# EAGLE schematic atmega_fusebit_doctor_V2hOld (EAGLE 6.4)
AUTHOR: PAWEL KISIELEWSKI (MANEKINEN); REV: 2.0
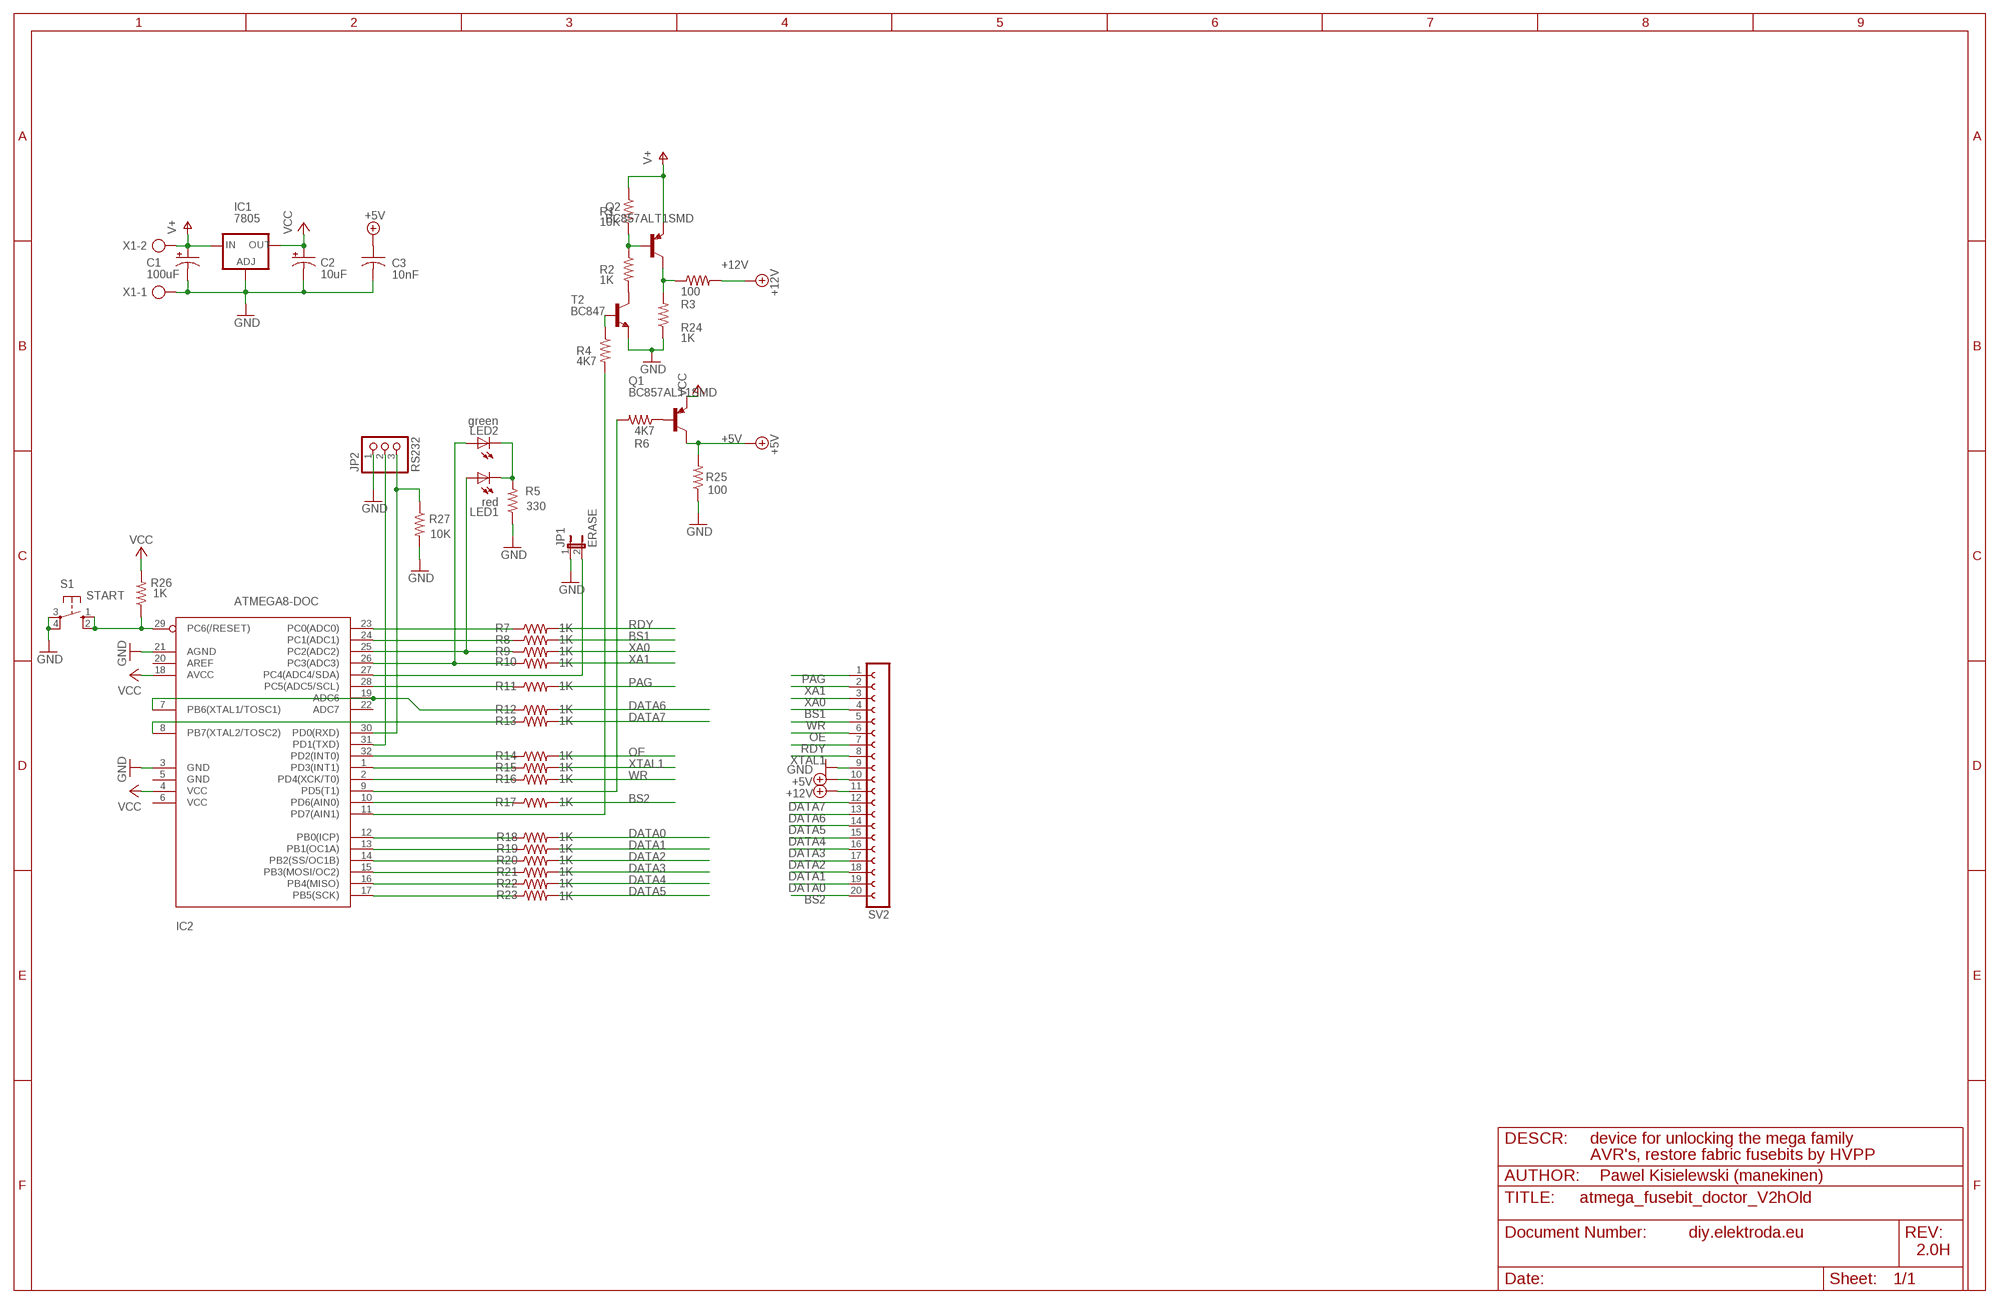
[diagram p0: schematic, sheet 1]

## Parts
C1  100uF  CAP_POL1206  [EIA3216]
C2  10uF  CAP_POL1206  [EIA3216]
C3  10nF  C-USC0805  [C0805]
IC1  7805  V_REG_317DPACK  [V-REG_DPACK]
IC2  ATMEGA8-DOC  AVR-MEGA8-AI  [TQFP32-08]
JP1  ERASE  JP1E  [JP1]
JP2  RS232  PINHD-1X3  [1X03]
LED1  red  LEDSML0603  [SML0603]
LED2  green  LEDSML0603  [SML0603]
Q1  BC857ALT1SMD  [SOT23-BEC]
Q2  BC857ALT1SMD  [SOT23-BEC]
R1  10K  R-US_R0805  [R0805]
R2  1K  R-US_R0805  [R0805]
R3  100  R-US_R0805  [R0805]
R4  4K7  R-US_R0805  [R0805]
R5  330  R-US_R0805  [R0805]
R6  4K7  R-US_R0805  [R0805]
R7  1K  R-US_R0805  [R0805]
R8  1K  R-US_R0805  [R0805]
R9  1K  R-US_R0805  [R0805]
R10  1K  R-US_R0805  [R0805]
R11  1K  R-US_R0805  [R0805]
R12  1K  R-US_R0805  [R0805]
R13  1K  R-US_R0805  [R0805]
R14  1K  R-US_R0805  [R0805]
R15  1K  R-US_R0805  [R0805]
R16  1K  R-US_R0805  [R0805]
R17  1K  R-US_R0805  [R0805]
R18  1K  R-US_R0805  [R0805]
R19  1K  R-US_R0805  [R0805]
R20  1K  R-US_R0805  [R0805]
R21  1K  R-US_R0805  [R0805]
R22  1K  R-US_R0805  [R0805]
R23  1K  R-US_R0805  [R0805]
R24  1K  R-US_R0805  [R0805]
R25  100  R-US_R0805  [R0805]
R26  1K  R-US_R0805  [R0805]
R27  10K  R-US_R0805  [R0805]
S1  START  10-XX  [B3F-10XX]
SV2  FE20-1  [FE20]
T2  BC847  [SOT23]
X1  AK500/2  [AK500/2]

## Nets
+5V: C3.1 Q1.C R25.2 SV2.10
+12V: R3.2 SV2.11
BS1: R8.2 SV2.4
BS2: R17.2 SV2.20
DATA0: R18.2 SV2.19
DATA1: R19.2 SV2.18
DATA2: R20.2 SV2.17
DATA3: R21.2 SV2.16
DATA4: R22.2 SV2.15
DATA5: R23.2 SV2.14
DATA6: R12.2 SV2.13
DATA7: R13.2 SV2.12
GND: C1.C(-) C2.C(-) C3.2 IC1.1(ADJ) IC2.3(GND) IC2.21(AGND) JP1.1 JP2.1 R5.1 R24.1 R25.1 R27.2 S1.3(P) S1.4(P1) SV2.9 T2.2(E) X1.1
N$1: Q1.B R6.1
N$2: IC2.12(PB0(ICP)) R18.1
N$3: IC2.31(PD1(TXD)) JP2.2
N$4: IC2.28(PC5(ADC5/SCL)) R11.1
N$5: IC2.2(PD4(XCK/T0)) R16.1
N$6: IC2.32(PD2(INT0)) R14.1
N$7: IC2.30(PD0(RXD)) JP2.3 R27.1
N$8: R2.2 T2.3(C)
N$9: IC2.7(PB6(XTAL1/TOSC1)) IC2.19(ADC6) R12.1
N$10: IC2.8(PB7(XTAL2/TOSC2)) R13.1
N$11: IC2.11(PD7(AIN1)) R4.2
N$12: IC2.9(PD5(T1)) R6.2
N$14: IC2.13(PB1(OC1A)) R19.1
N$16: IC2.14(PB2(SS/OC1B)) R20.1
N$19: IC2.1(PD3(INT1)) R15.1
N$21: IC2.23(PC0(ADC0)) R7.1
N$22: Q2.C R3.1 R24.2
N$24: IC2.15(PB3(MOSI/OC2)) R21.1
N$25: IC2.16(PB4(MISO)) R22.1
N$26: IC2.17(PB5(SCK)) R23.1
N$27: IC2.10(PD6(AIN0)) R17.1
N$29: R4.1 T2.1(B)
N$31: IC2.27(PC4(ADC4/SDA)) JP1.2
N$32: LED1.C LED2.C R5.2
N$34: Q2.B R1.2 R2.1
N$42: IC2.24(PC1(ADC1)) R8.1
N$43: IC2.29(PC6(/RESET)) R26.1 S1.1(S) S1.2(S1)
N$47: IC2.26(PC3(ADC3)) LED2.A R10.1
N$48: IC2.25(PC2(ADC2)) LED1.A R9.1
OE: R14.2 SV2.6
PAG: R11.2 SV2.1
RDY: R7.2 SV2.7
V+: C1.A(+) IC1.3(IN) Q2.E R1.1 X1.2
VCC: C2.A(+) IC1.4(OUT) IC2.4(VCC) IC2.18(AVCC) Q1.E R26.2
WR: R16.2 SV2.5
XA0: R9.2 SV2.3
XA1: R10.2 SV2.2
XTAL1: R15.2 SV2.8
Unconnected: IC2.5(GND) IC2.6(VCC) IC2.20(AREF) IC2.22(ADC7)

## Notes on the sheet
- DESCR: | device for unlocking the mega family
- AVR's, restore fabric fusebits by HVPP
- AUTHOR: | Pawel Kisielewski (manekinen)
- diy.elektroda.eu
- 2.0H

## Library data of the parts
C1 C2 = SparkFun:CAP_POL: Capacitor Polarized These are standard SMD and PTH capacitors. Normally 10uF, 47uF, and 100uF in electrolytic and tantalum varieties. Always verify the external diameter of the through hole cap, it varies with capacity, voltage, and manufacturer. The EIA devices should be standard.
C3 = resistor:C-US: CAPACITOR, American symbol
IC1 = SparkFun:V_REG_317: Voltage Regulator Standard LM317 adjustable voltage regulator. AOI (Adjust Output Input). Google 'LM317 Calculator' for easy to use app to get the two resistor values needed. 240/720 for 5V output. 240/390 for 3.3V output. Spark Fun Electronics SKU : COM-00527
IC2 = SparkFun:AVR-MEGA8: MICROCONTROLLER 8 Kbytes FLASH 1 kbytes SRAM 512 bytes EEPROM USART 6-channel 10 bit ADC 2-channel 8 bit ADC
JP1 = jumper:JP1E: JUMPER
JP2 = pinhead:PINHD-1X3: PIN HEADER
LED1 LED2 = led:LED: LED OSRAM: - CHIPLED LG R971, LG N971, LY N971, LG Q971, LY Q971, LO R971, LY R971 LH N974, LH R974 LS Q976, LO Q976, LY Q976 LO Q996 - Hyper CHIPLED LW Q18S LB Q993, LB Q99A, LB R99A - SideLED LS A670, LO A670, LY A670, LG A670, LP A670 LB A673, LV A673, LT A673, LW A673 LH A674 LY A675 LS A676, LA A676, LO A676, LY A676, LW A676 LS A679, LY A679, LG A679 - Hyper Micro SIDELED® LS Y876, LA Y876, LO Y876, LY Y876 LT Y87S - SmartLED LW L88C, LW L88S LB L89C, LB L89S, LG L890 LS L89K, LO L89K, LY L89K LS L896, LA L896, LO L896, LY L896 - TOPLED LS T670, LO T670, LY T670, LG T670, LP T670 LSG T670, LSP T670, LSY T670, LOP T670, LYG T670 LG T671, LOG T671, LSG T671 LB T673, LV T673, LT T673, LW T673 LH T674 LS T676, LA T676, LO T676, LY T676, LB T676, LH T676, LSB T676, LW T676 LB T67C, LV T67C, LT T67C, LS T67K, LO T67K, LY T67K, LW E67C LS E67B, LA E67B, LO E67B, LY E67B, LB E67C, LV E67C, LT E67C LW T67C LS T679, LY T679, LG T679 LS T770, LO T770, LY T770, LG T770, LP T770 LB T773, LV T773, LT T773, LW T773 LH T774 LS E675, LA E675, LY E675, LS T675 LS T776, LA T776, LO T776, LY T776, LB T776 LHGB T686 LT T68C, LB T68C - Hyper Mini TOPLED® LB M676 - Mini TOPLED Santana® LG M470 LS M47K, LO M47K, LY M47K Source: http://www.osram.convergy.de LUXEON: - LUMILED® LXK2-PW12-R00, LXK2-PW12-S00, LXK2-PW14-U00, LXK2-PW14-V00 LXK2-PM12-R00, LXK2-PM12-S00, LXK2-PM14-U00 LXK2-PE12-Q00, LXK2-PE12-R00, LXK2-PE12-S00, LXK2-PE14-T00, LXK2-PE14-U00 LXK2-PB12-K00, LXK2-PB12-L00, LXK2-PB12-M00, LXK2-PB14-N00, LXK2-PB14-P00, LXK2-PB14-Q00 LXK2-PR12-L00, LXK2-PR12-M00, LXK2-PR14-Q00, LXK2-PR14-R00 LXK2-PD12-Q00, LXK2-PD12-R00, LXK2-PD12-S00 LXK2-PH12-R00, LXK2-PH12-S00 LXK2-PL12-P00, LXK2-PL12-Q00, LXK2-PL12-R00 Source: www.luxeon.com KINGBRIGHT: KA-3528ASYC Source: www.kingbright.com
Q1 Q2 = transistor-pnp:BC857*: PNP Transistror
R1-R27 = resistor:R-US_: RESISTOR, American symbol
S1 = switch-omron:10-XX: OMRON SWITCH
SV2 = con-lsta:FE20-1: FEMALE HEADER
T2 = transistor:BC847: NPN TRANSISTOR
X1 = con-ptr500:AK500/2: CONNECTOR